# Altium schematic sheet DOut.SchDoc
size A3; SheetNumber: 6; SheetTotal: 6
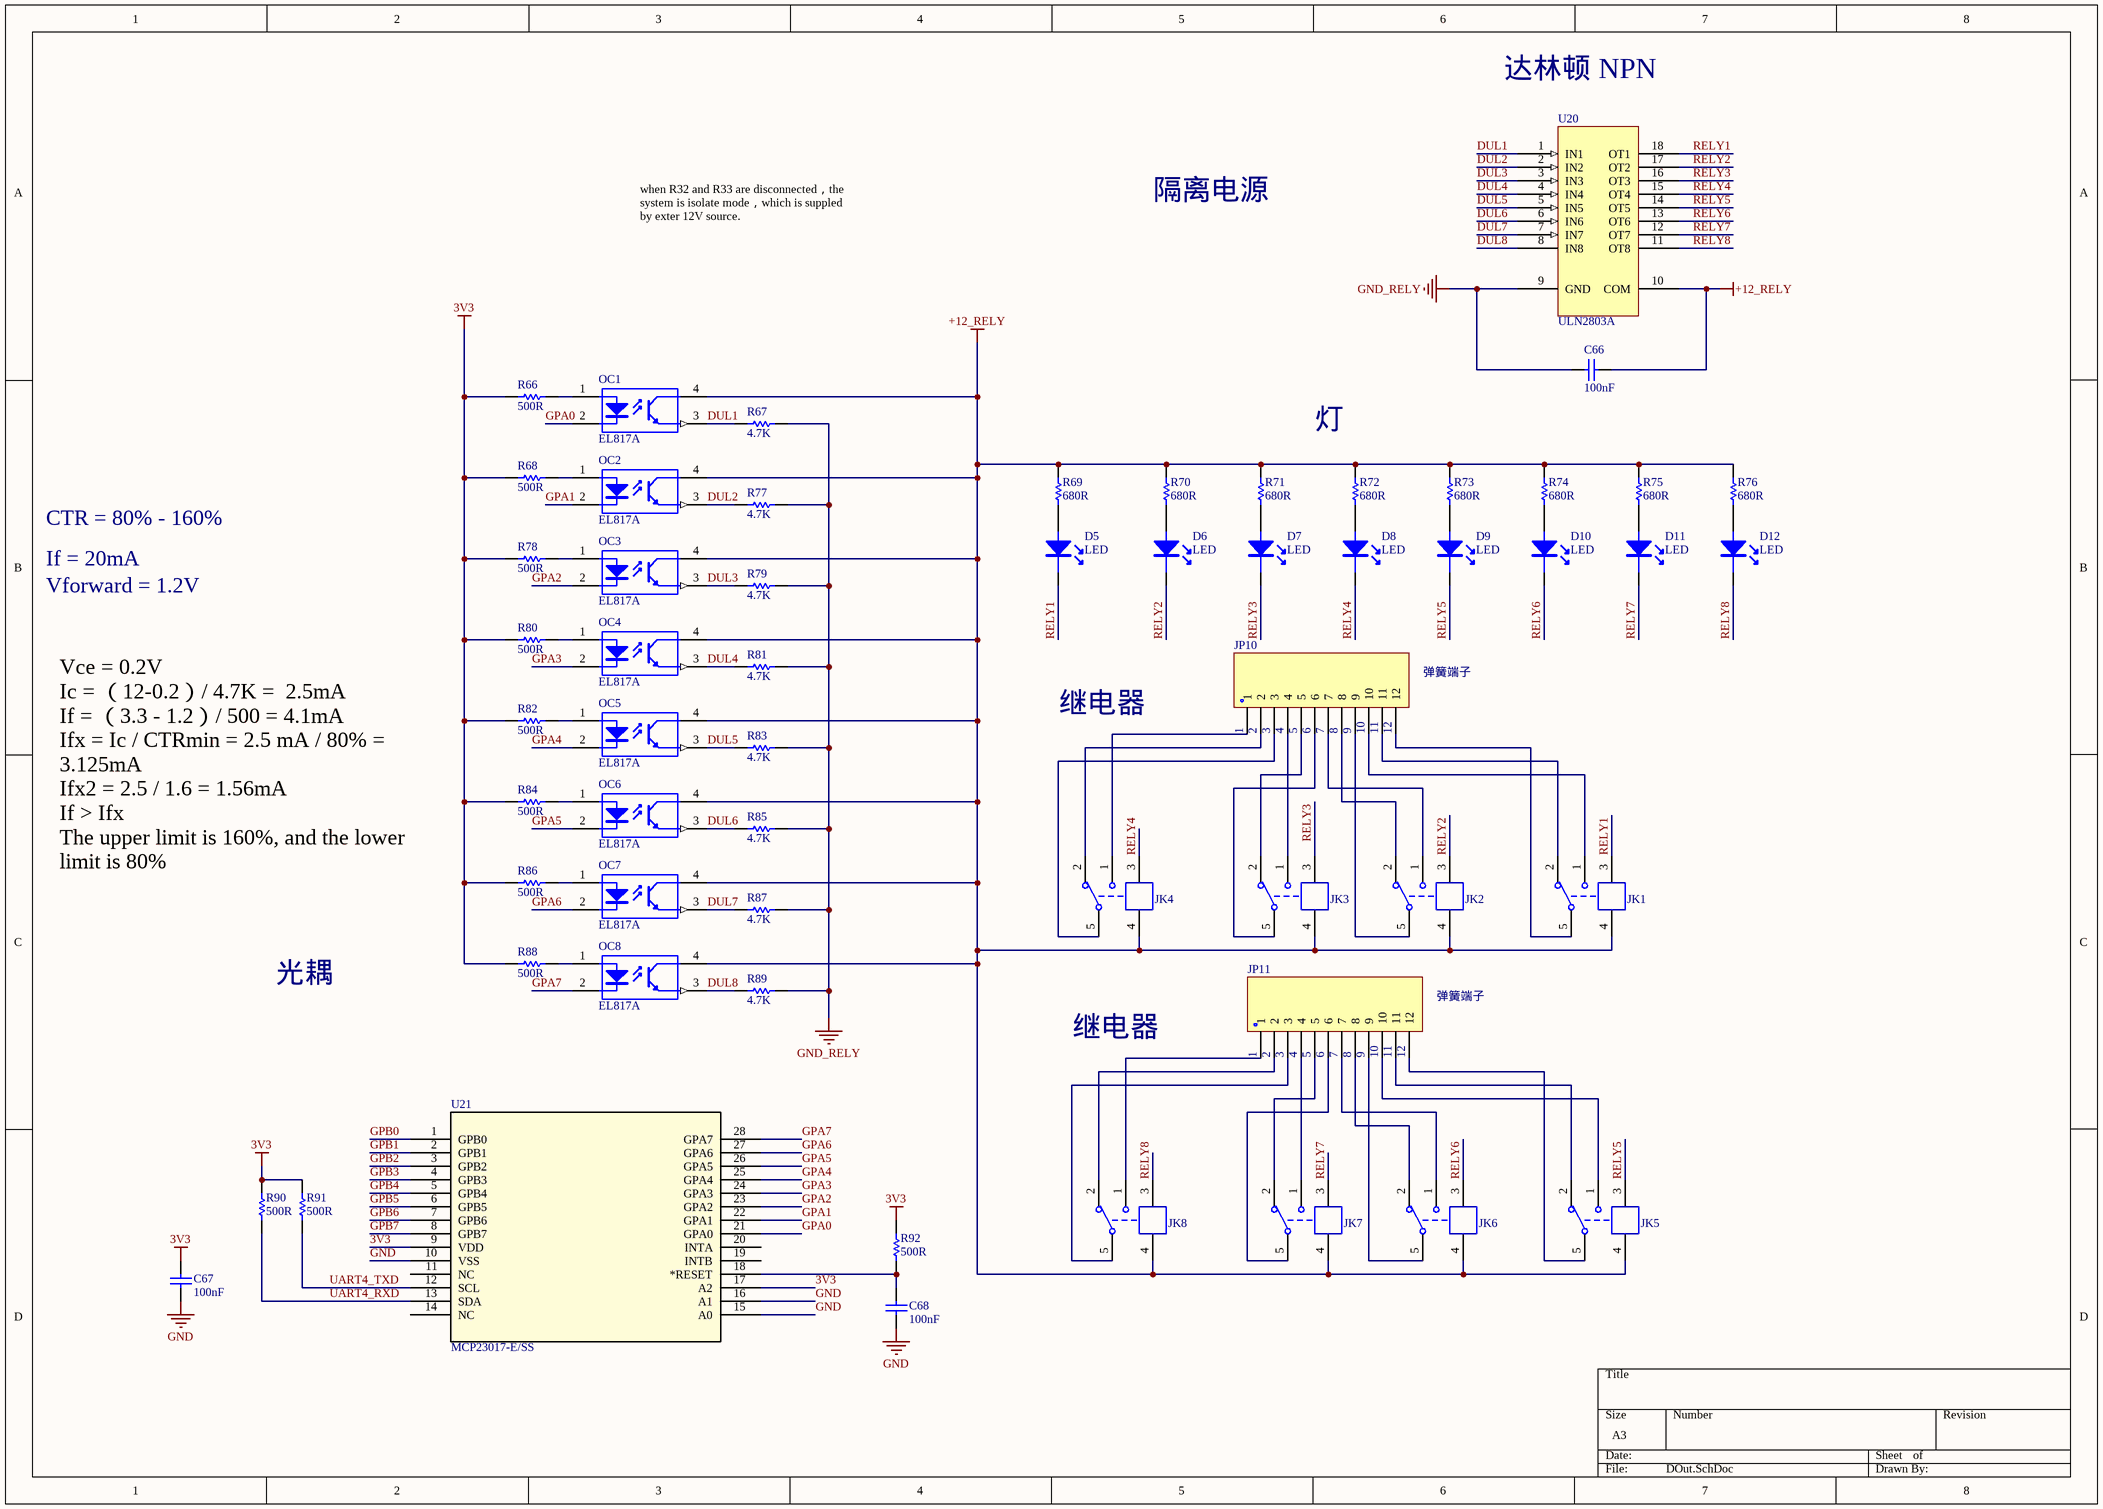
[diagram p0: DOut.SchDoc]

## Parts
C66  100nF  [0603C]
C67  100nF  [0603C]
C68  100nF  [0603C]
D5  LED  [LED-0603G]
D6  LED  [LED-0603G]
D7  LED  [LED-0603G]
D8  LED  [LED-0603G]
D9  LED  [LED-0603G]
D10  LED  [LED-0603G]
D11  LED  [LED-0603G]
D12  LED  [LED-0603G]
JK1  JS-12-K  [JS-12-K]  (value not drawn)
JK2  JS-12-K  [JS-12-K]  (value not drawn)
JK3  JS-12-K  [JS-12-K]  (value not drawn)
JK4  JS-12-K  [JS-12-K]  (value not drawn)
JK5  JS-12-K  [JS-12-K]  (value not drawn)
JK6  JS-12-K  [JS-12-K]  (value not drawn)
JK7  JS-12-K  [JS-12-K]  (value not drawn)
JK8  JS-12-K  [JS-12-K]  (value not drawn)
JP10  弹簧端子  [DB142V-5.08-12P]
JP11  弹簧端子  [DB142V-5.08-12P]
OC1  EL817A  [SMD_PC817]
OC2  EL817A  [SMD_PC817]
OC3  EL817A  [SMD_PC817]
OC4  EL817A  [SMD_PC817]
OC5  EL817A  [SMD_PC817]
OC6  EL817A  [SMD_PC817]
OC7  EL817A  [SMD_PC817]
OC8  EL817A  [SMD_PC817]
R66  500R  [0603r]
R67  4.7K  [0603R]
R68  500R  [0603r]
R69  680R  [0603r]
R70  680R  [0603r]
R71  680R  [0603r]
R72  680R  [0603r]
R73  680R  [0603r]
R74  680R  [0603r]
R75  680R  [0603r]
R76  680R  [0603r]
R77  4.7K  [0603R]
R78  500R  [0603r]
R79  4.7K  [0603R]
R80  500R  [0603r]
R81  4.7K  [0603R]
R82  500R  [0603r]
R83  4.7K  [0603R]
R84  500R  [0603r]
R85  4.7K  [0603R]
R86  500R  [0603r]
R87  4.7K  [0603R]
R88  500R  [0603r]
R89  4.7K  [0603R]
R90  500R  [0603r]
R91  500R  [0603r]
R92  500R  [0603r]
U20  ULN2803A  [SOP18 - 300mil]
U21  MCP23017-E/SS  [SSOP28_MC_MCH]

## Nets
3V3: C67.2 R66.2 R68.2 R78.2 R80.2 R82.2 R84.2 R86.2 R88.2 R90.2 R91.2 R92.2 U21.9(VDD) U21.17(A2)
+12_RELY: C66.2 JK1.4 JK2.4 JK3.4 JK4.4 JK5.4 JK6.4 JK7.4 JK8.4 OC1.4(C) OC2.4(C) OC3.4(C) OC4.4(C) OC5.4(C) OC6.4(C) OC7.4(C) OC8.4(C) R69.1 R70.1 R71.1 R72.1 R73.1 R74.1 R75.1 R76.1 U20.10(COM)
GND: C67.1 C68.1 U21.10(VSS) U21.15(A0) U21.16(A1)
GND_RELY: C66.1 R67.2 R77.2 R79.2 R81.2 R83.2 R85.2 R87.2 R89.2 U20.9(GND)
DUL1: OC1.3(E) R67.1 U20.1(IN1)
DUL2: OC2.3(E) R77.1 U20.2(IN2)
DUL3: OC3.3(E) R79.1 U20.3(IN3)
DUL4: OC4.3(E) R81.1 U20.4(IN4)
DUL5: OC5.3(E) R83.1 U20.5(IN5)
DUL6: OC6.3(E) R85.1 U20.6(IN6)
DUL7: OC7.3(E) R87.1 U20.7(IN7)
DUL8: OC8.3(E) R89.1 U20.8(IN8)
GPA0: OC1.2(K) U21.21(GPA0)
GPA1: OC2.2(K) U21.22(GPA1)
GPA2: OC3.2(K) U21.23(GPA2)
GPA3: OC4.2(K) U21.24(GPA3)
GPA4: OC5.2(K) U21.25(GPA4)
GPA5: OC6.2(K) U21.26(GPA5)
GPA6: OC7.2(K) U21.27(GPA6)
GPA7: OC8.2(K) U21.28(GPA7)
GPB0: U21.1(GPB0)
GPB1: U21.2(GPB1)
GPB2: U21.3(GPB2)
GPB3: U21.4(GPB3)
GPB4: U21.5(GPB4)
GPB5: U21.6(GPB5)
GPB6: U21.7(GPB6)
GPB7: U21.8(GPB7)
RELY1: D5.2(K) JK1.3 U20.18(OT1)
RELY2: D6.2(K) JK2.3 U20.17(OT2)
RELY3: D7.2(K) JK3.3 U20.16(OT3)
RELY4: D8.2(K) JK4.3 U20.15(OT4)
RELY5: D9.2(K) JK5.3 U20.14(OT5)
RELY6: D10.2(K) JK6.3 U20.13(OT6)
RELY7: D11.2(K) JK7.3 U20.12(OT7)
RELY8: D12.2(K) JK8.3 U20.11(OT8)
UART4_RXD: R90.1 U21.13(SDA)
UART4_TXD: R91.1 U21.12(SCL)
NetC68_2: C68.2 R92.1 U21.18(*RESET)
NetD5_1: D5.1(A) R69.2
NetD6_1: D6.1(A) R70.2
NetD7_1: D7.1(A) R71.2
NetD8_1: D8.1(A) R72.2
NetD9_1: D9.1(A) R73.2
NetD10_1: D10.1(A) R74.2
NetD11_1: D11.1(A) R75.2
NetD12_1: D12.1(A) R76.2
NetJK1_1: JK1.1 JP10.10
NetJK1_2: JK1.2 JP10.11
NetJK1_5: JK1.5 JP10.12
NetJK2_1: JK2.1 JP10.7
NetJK2_2: JK2.2 JP10.8
NetJK2_5: JK2.5 JP10.9
NetJK3_1: JK3.1 JP10.4
NetJK3_2: JK3.2 JP10.5
NetJK3_5: JK3.5 JP10.6
NetJK4_1: JK4.1 JP10.1
NetJK4_2: JK4.2 JP10.2
NetJK4_5: JK4.5 JP10.3
NetJK5_1: JK5.1 JP11.10
NetJK5_2: JK5.2 JP11.11
NetJK5_5: JK5.5 JP11.12
NetJK6_1: JK6.1 JP11.7
NetJK6_2: JK6.2 JP11.8
NetJK6_5: JK6.5 JP11.9
NetJK7_1: JK7.1 JP11.4
NetJK7_2: JK7.2 JP11.5
NetJK7_5: JK7.5 JP11.6
NetJK8_1: JK8.1 JP11.1
NetJK8_2: JK8.2 JP11.2
NetJK8_5: JK8.5 JP11.3
NetOC1_1: OC1.1(A) R66.1
NetOC2_1: OC2.1(A) R68.1
NetOC3_1: OC3.1(A) R78.1
NetOC4_1: OC4.1(A) R80.1
NetOC5_1: OC5.1(A) R82.1
NetOC6_1: OC6.1(A) R84.1
NetOC7_1: OC7.1(A) R86.1
NetOC8_1: OC8.1(A) R88.1

Not connected (* = marked no-connect by the designer): U21 11(NC) 14(NC) 19(INTB) 20(INTA)

## Notes on the sheet
- 达林顿 NPN
- when R32 and R33 are disconnected，the system is isolate mode，which is suppled by exter 12V source.
- 隔离电源
- 灯
- CTR = 80% - 160%
- If = 20mA
- Vforward = 1.2V
- 继电器
- Vce = 0.2V
  Ic = （12-0.2）/ 4.7K =  2.5mA
  If = （3.3 - 1.2）/ 500 = 4.1mA
  Ifx = Ic / CTRmin = 2.5 mA / 80% = 3.125mA
  Ifx2 = 2.5 / 1.6 = 1.56mA
  If > Ifx
  The upper limit is 160%, and the lower limit is 80%
- 光耦

## Library data of the parts
C66-C68 = CAP: Capacitor; Value: 104; Published: 8-Jun-2000; LatestRevisionDate: 17-Jul-2002; LatestRevisionNote: Re-released for DXP Platform.; PackageReference: RAD-0.3; Publisher: Altium Limited
D5-D12 = LED: LED 发光二极管
JK1-JK8 = JS-12-K: 12V一组转换
JP10 JP11 = DB142V-5.08-12P
OC1-OC8 = EL357N: 线性光耦
R66-R92 = RES: Resistor; Value: 1K; Published: 8-Jun-2000; Revision: July-2002: Re-released for DXP Platform.; Publisher: Altium Limited
U20 = ULN2803A: 8 channels Darlington
U21 = MCP23017-E/SS: No Description Available; Mfr_Name: Microchip; Copyright: Copyright (C) 2021 Ultra Librarian. All rights reserved.; Manufacturer_Part_Number: MCP23017-E/SS; RefDes: RefDes; Type: DEV